# Altium schematic sheet subckt_LDO_EMI_filter.SchDoc: LDO EMI filter
size A3; DocumentNumber: 9; Revision: 0; SheetNumber: 9; SheetTotal: 19
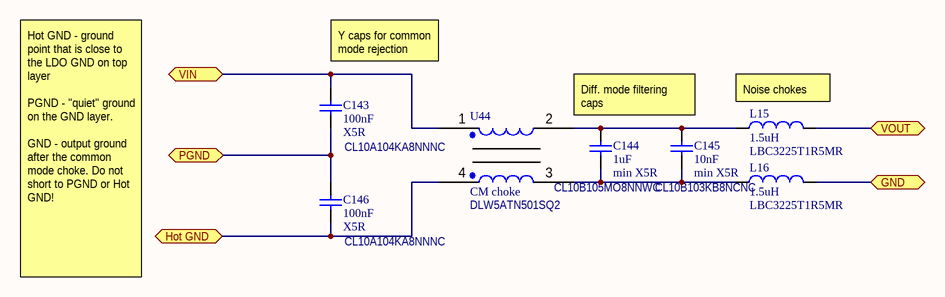
[diagram p0: subckt_LDO_EMI_filter.SchDoc]

## Parts
C143  value 100nF  Dielectric: X5R  Model: CL10A104KA8NNNC  [CAP0603]  (hidden comment: Capacitor)
C144  value 1uF  Dielectric: min X5R  Model: CL10B105MO8NNWC  [CAP0603]  (hidden comment: Capacitor)
C145  value 10nF  Dielectric: min X5R  Model: CL10B103KB8NCNC  [CAP0603]  (hidden comment: Capacitor)
C146  value 100nF  Dielectric: X5R  Model: CL10A104KA8NNNC  [CAP0603]  (hidden comment: Capacitor)
L15  value 1.5uH  Model: LBC3225T1R5MR  [IND 1210]  (hidden comment: Inductor)
L16  value 1.5uH  Model: LBC3225T1R5MR  [IND 1210]  (hidden comment: Inductor)
U44  CM choke  Model: DLW5ATN501SQ2  [Murata_DLW5A/5B]

## Ports
GND, Hot GND, PGND, VIN, VOUT

## Nets
GND: L16.2 ; port GND
Hot GND: C146.1 U44.4 ; port Hot GND
PGND: C143.1 C146.2 ; port PGND
VIN: C143.2 U44.1 ; port VIN
VOUT: L15.2 ; port VOUT
NetC144_1: C144.1 C145.1 L16.1 U44.3
NetC144_2: C144.2 C145.2 L15.1 U44.2

## Notes on the sheet
- (near C143) Y caps for common mode rejection
- Diff. mode filtering caps
- (near L15) Noise chokes
- Hot GND - ground point that is close to the LDO GND on top layer
  PGND - "quiet" ground on the GND layer.
  GND - output ground after the common mode choke. Do not short to PGND or Hot GND!

## Library data of the parts
U44 = Common_choke: Common mode choke